# Altium schematic sheet TLV62569.SchDoc
size A; SheetNumber: 3; SheetTotal: 4
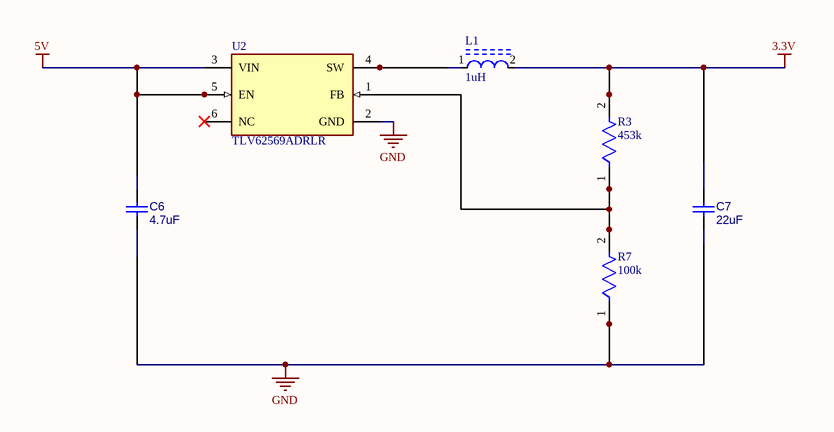
[diagram p0: TLV62569.SchDoc]

## Parts
C6  4.7uF  [CAPC1608X09N]
C7  22uF  [CAPC1608X09N]
L1  1uH  [FP-SRN8040-MFG]
R3  453k  [FP-CRCW0402-e3-MFG]
R7  100k  [FP-CRCW0402-e3-IPC_C]
U2  TLV62569ADRLR  [FP-DRL0006A-MFG]

## Nets
3.3V: C7.2 L1.2 R3.2
5V: C6.2 U2.3(VIN) U2.5(EN)
GND: C6.1 C7.1 R7.1 U2.2(GND)
NetL1_1: L1.1 U2.4(SW)
NetR3_1: R3.1 R7.2 U2.1(FB)

Not connected (* = marked no-connect by the designer): U2 6(NC)*

## Library data of the parts
C6 = CMP-003-000096-1: CAP CER 4.7uF 25V X5R Symbols/Capacitor-Generic.SchLib; Manufacturer 1: Murata; Manufacturer Part Number 1: GRM188R61E475KE11#; Part Number: CAP-0603-000094; Tolerance: 10%; Value: 4.7µF; Symbol Path: Symbols/Capacitor-Generic.SchLib; Voltage: 25V; Temperature Characteristic: X5R
C7 = CMP-003-000012-1: CAP CER 22uF 10V X5R Symbols/Capacitor-Generic.SchLib; Part Number: CAP-0603-000010; Manufacturer Part Number 1: GRM187R61A226ME15#; Manufacturer 1: Murata; Value: 22µF; Tolerance: 20%; Voltage: 10V; Symbol Path: Symbols/Capacitor-Generic.SchLib; Temperature Characteristic: X5R
L1 = CMP-07248-000040-1: FIXED IND 1UH 7.8A 10 MOHM SMD; Inductance Tolerance: 30%; DC Resistance (DCR): 10mR; Self Resonant Frequency: 75MHz; Shielding: Shielded; Saturation Current: 11A; Core Material: Ferrite; Test Frequency: 100kHz; Current Rating: 7.8A; Composition: Wirewound; Height: 4mm; Number of Pins: 2; Inductance: 1uH; Depth: 8.3mm; REACH SVHC: No SVHC; Length: 8mm; DC Current: 7.8A; Package Quantity: 1000; Height - Seated (Max): 0.157inch; Termination: SMD/SMT; Packaging: Tape and Reel; Max DC Current: 7.8A; Min Operating Temperature: -40°C; Max Operating Temperature: 125°C; Case/Package: Nonstandard; Mount: Surface Mount; Military Standard: Not; RMS Current (Irms): 7.8A; Width: 8mm; Tolerance: 30%
R3 = CMP-2002-00012-2: RES Thick Film, 453kΩ, 1%, 0.063W, 100ppm/°C, 0402; Resistance: 453kR; Voltage Rating (DC): 50V; Power Rating: 63mW; Features: Automotive AEC-Q200; Termination: SMD/SMT; Weight: 2.3E-05oz; Resistor Type: Thick Film; Size Code: 0402; Height: 0.016inch; RoHS Compliant: Yes; Resistance Tolerance: 1%; Construction: Rectangular; Radiation Hardening: No; Temperature Coefficient: 100ppm/°C; Series: CRCW; Depth: 0.5mm; Lead Free: Lead Free; Min Operating Temperature: -55°C; Package Quantity: 10; Length: 1mm; Case Code (Metric): 1005; Tolerance: 1%; Max Operating Temperature: 155°C; Voltage Rating: 50V; Packaging: Tape and Reel; Number of Pins: 2; Case Code (Imperial): 0402; Case/Package: 0402; Number of Terminations: 2; Contact Plating: Tin; Military Standard: Not; Max Power Dissipation: 63mW; Width: 0.5mm
R7 = CMP-2002-08123-3: RES Thick Film, 100kΩ, 1%, 0.063W, 100ppm/°C, 0402; Power Rating: 63mW; Resistance: 100kR; Voltage Rating (DC): 50V; Lead Free: Lead Free; Height: 0.35mm; Contact Plating: Tin; Min Operating Temperature: -55°C; Package Quantity: 10000; Case/Package: 0402; Temperature Coefficient: 100ppm/°C; Number of Terminations: 2; Packaging: Tape and Reel; Max Power Dissipation: 63mW; Case Code (Metric): 1005; Mount: Surface Mount; Width: 0.02inch; Termination: SMD/SMT; Length: 1mm; Number of Pins: 2; Weight: 2.3E-05oz; Radiation Hardening: No; Tolerance: 1%; Military Standard: Not; Features: Automotive AEC-Q200; Depth: 0.5mm; Composition: Thick Film; Max Operating Temperature: 155°C; Voltage Rating: 50V; Case Code (Imperial): 0402
U2 = CMP-04918-000167-1: IC REG BUCK ADJ 2A SOT563; Synchronous Rectifier: Yes; Output Configuration: Positive; Max Output Voltage: 5.5V; Switching Frequency: 1.5MHz; Min Input Voltage: 2.5V; Output Type: Adjustable; Min Output Voltage: 600mV; Case/Package: SOT-563; Output Current: 2A; Max Input Voltage: 5.5V; Mount: Surface Mount; Max Operating Temperature: 125°C; Min Operating Temperature: -40°C; Packaging: Tape and Reel